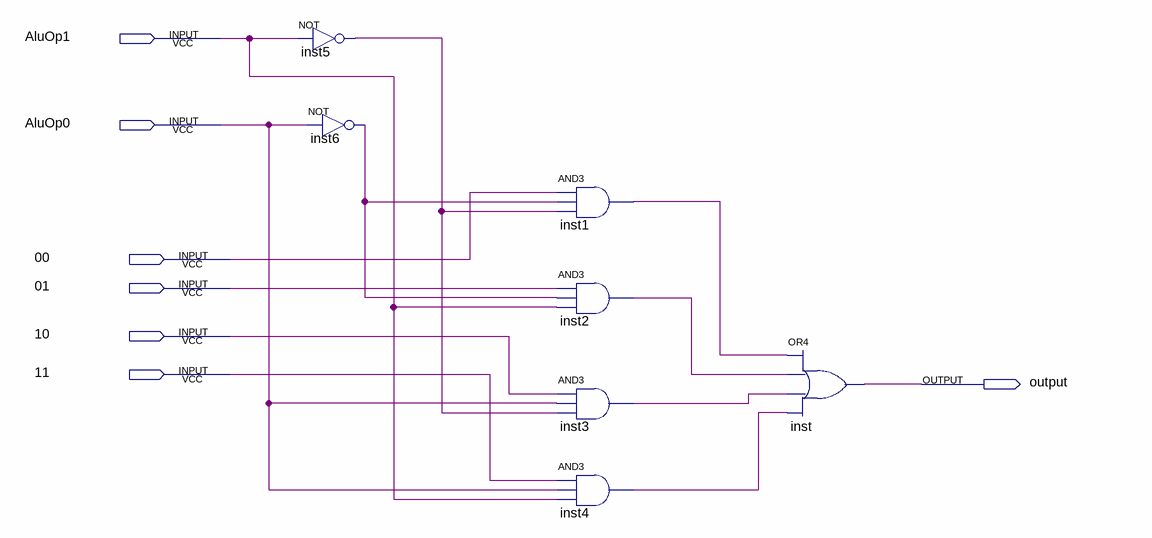
[diagram p0: schematic sheet]
// Quartus schematic demux4.bdf as structural Verilog: 7 symbols, 7 pins
module demux4 (
  input  AluOp1,
  input  AluOp0,
  input  \00 ,
  input  \01 ,
  input  \10 ,
  input  \11 ,
  output \output 
);

  wire inst1_out, inst2_out, inst3_out, inst4_out, inst5_out, inst6_out;

  not inst5 (inst5_out, AluOp1);
  not inst6 (inst6_out, AluOp0);
  and inst1 (inst1_out, \00 , inst6_out, inst5_out);
  and inst2 (inst2_out, \01 , inst6_out, AluOp1);
  and inst3 (inst3_out, \10 , AluOp0, inst5_out);
  and inst4 (inst4_out, \11 , AluOp0, AluOp1);
  or inst (\output , inst1_out, inst2_out, inst3_out, inst4_out);
endmodule
